# EAGLE design binaryClock (EAGLE 8.4.0)
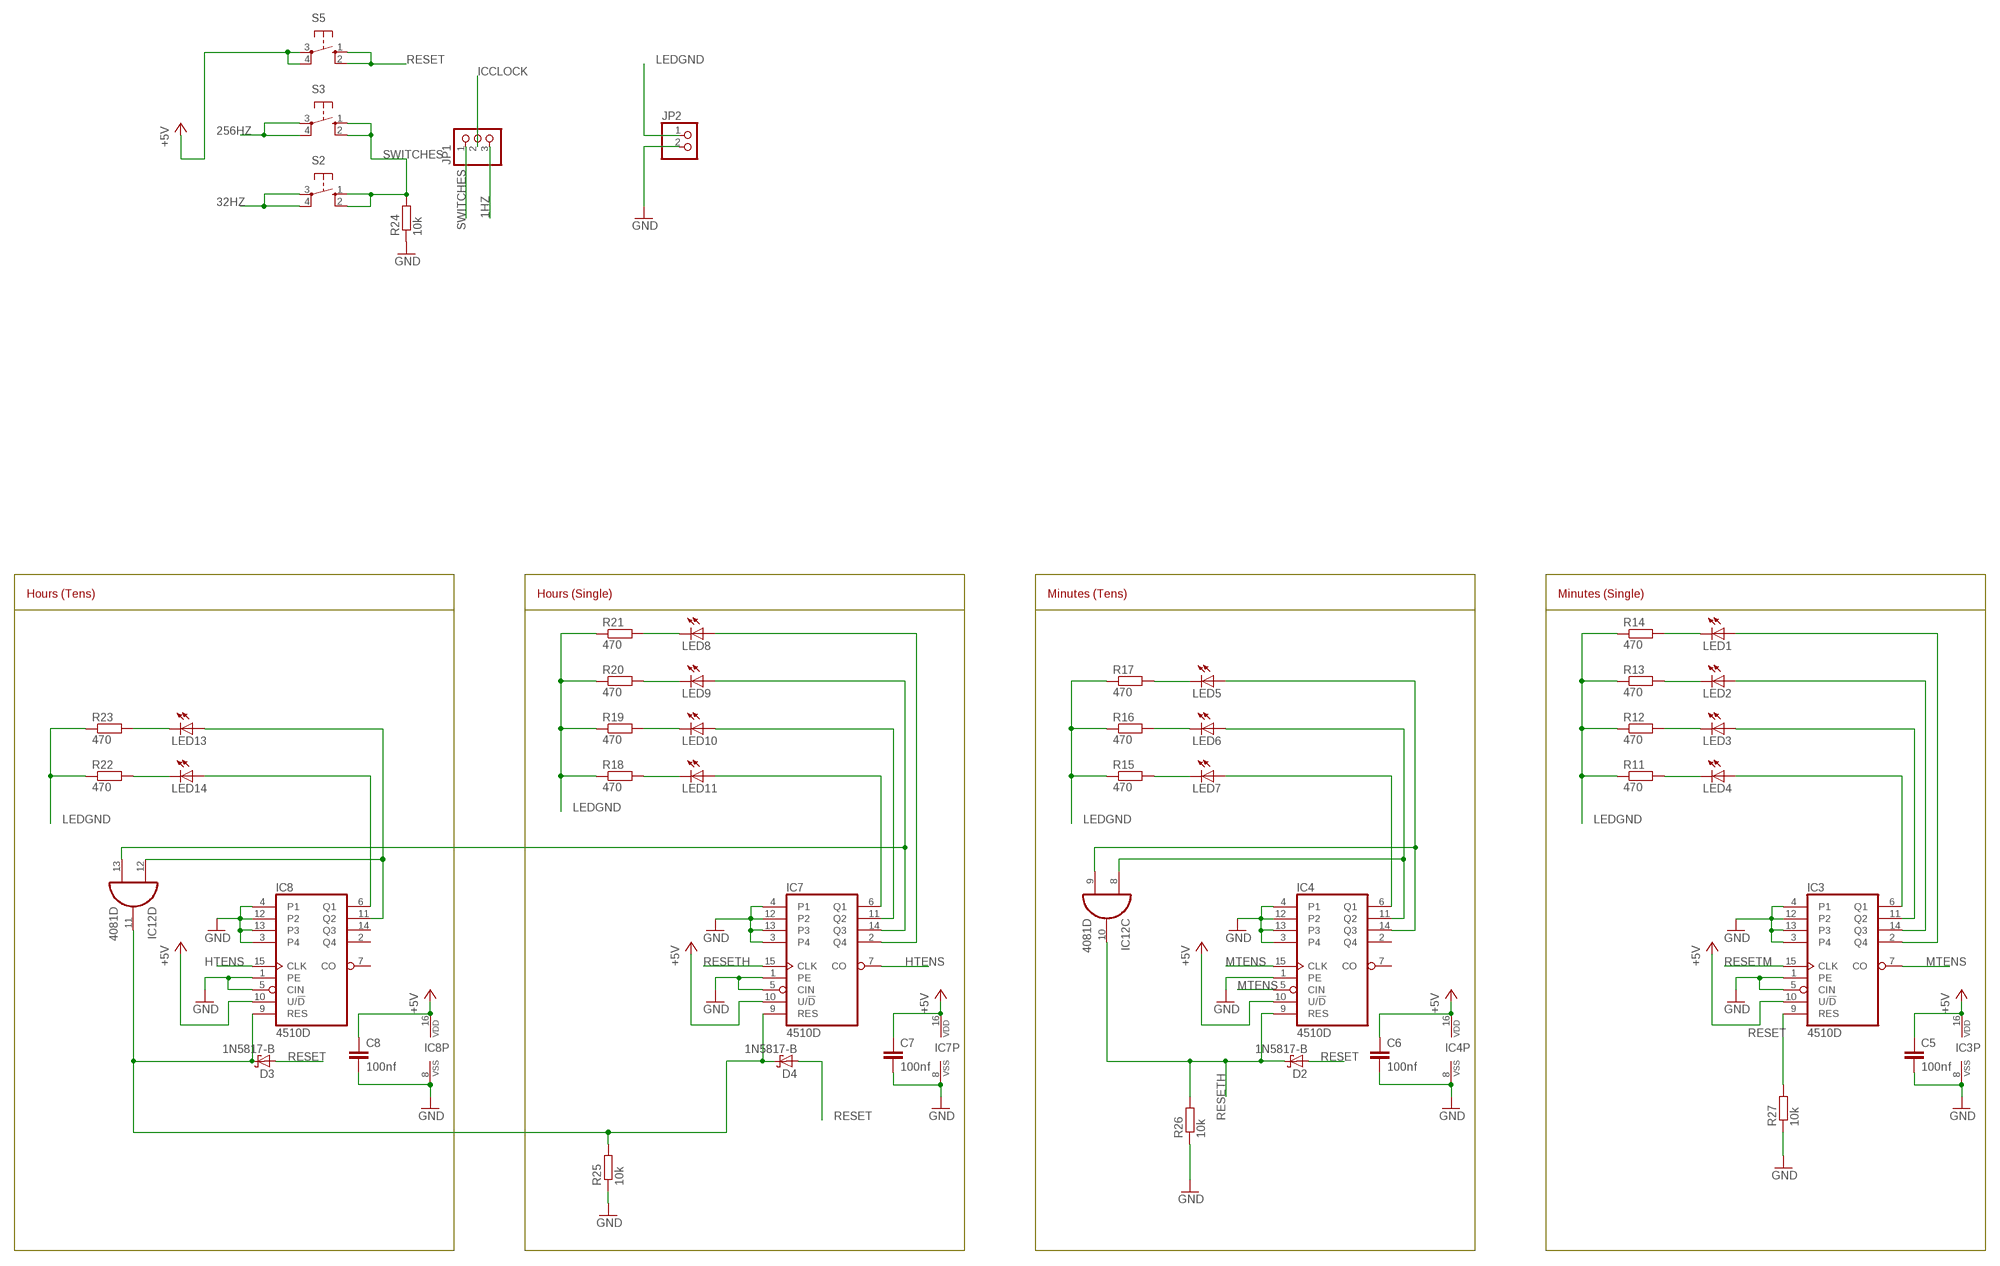
[diagram p0: schematic, sheet 1, part 1 of 2]
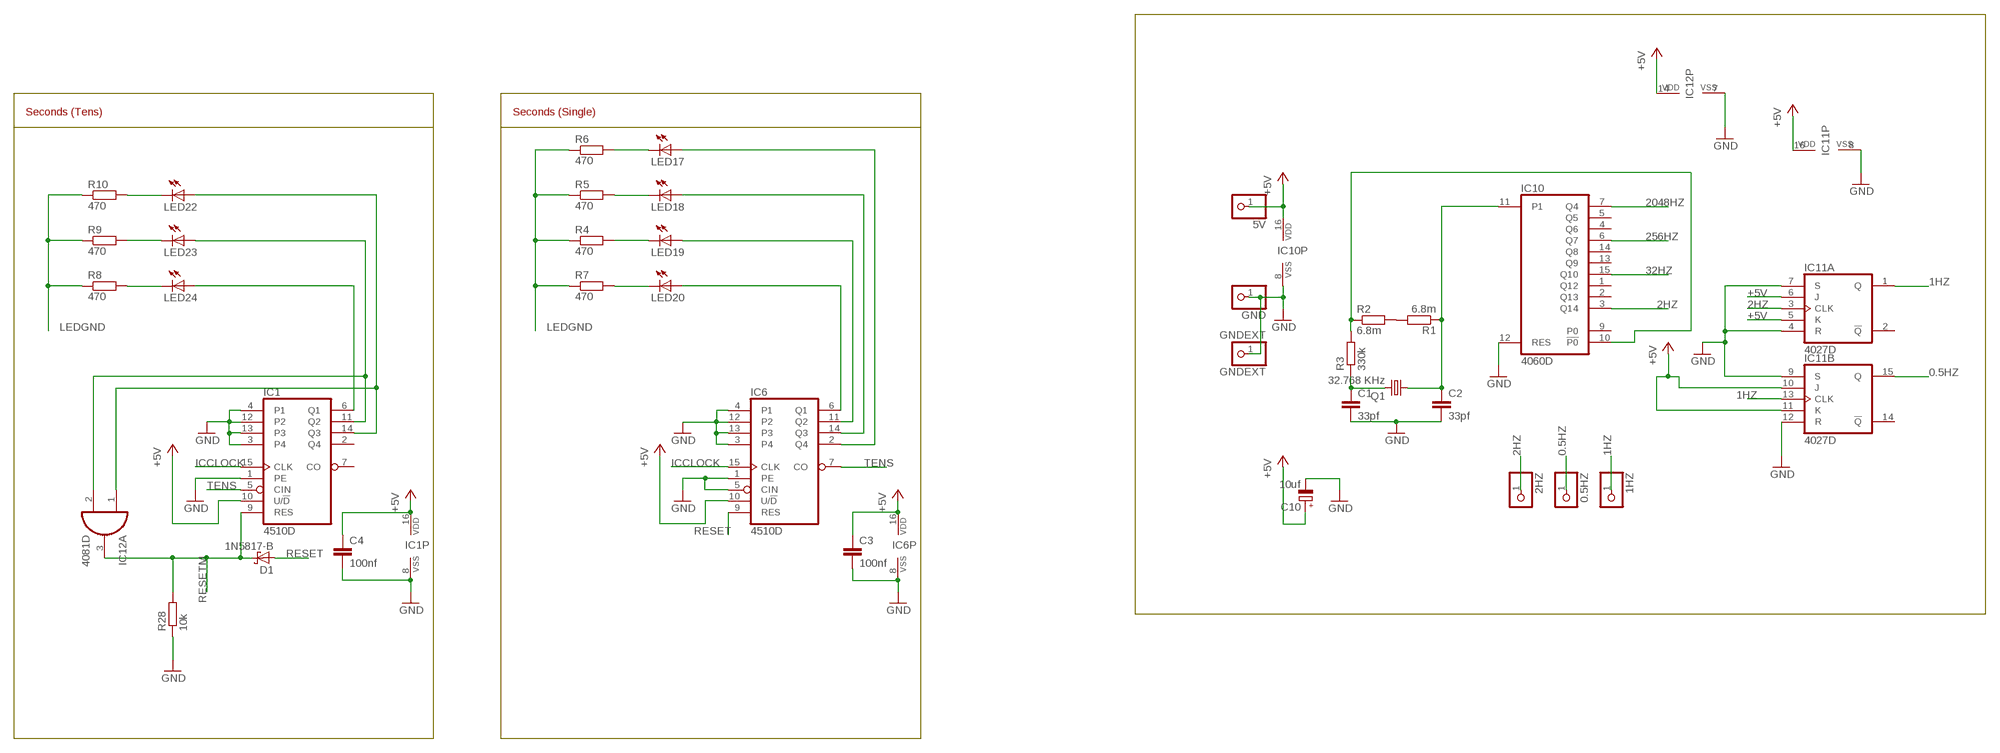
[diagram p1: schematic, sheet 1, part 2 of 2]

## Parts
0.5HZ  PINHD-1X1  [1X01]
1HZ  PINHD-1X1  [1X01]
2HZ  PINHD-1X1  [1X01]
5V  PINHD-1X1  [1X01]
C1  33pf  C-EU025-030X050  [C025-030X050]
C2  33pf  C-EU025-030X050  [C025-030X050]
C3  100nf  C-EU025-030X050  [C025-030X050]
C4  100nf  C-EU025-030X050  [C025-030X050]
C5  100nf  C-EU025-030X050  [C025-030X050]
C6  100nf  C-EU025-030X050  [C025-030X050]
C7  100nf  C-EU025-030X050  [C025-030X050]
C8  100nf  C-EU025-030X050  [C025-030X050]
C10  10uf  CPOL-EUE2.5-5  [E2,5-5]
D1  1N5817-B  [DO41-7.6]
D2  1N5817-B  [DO41-7.6]
D3  1N5817-B  [DO41-7.6]
D4  1N5817-B  [DO41-7.6]
GND  PINHD-1X1  [1X01]
GNDEXT  GNDEXT  PINHD-1X1  [1X01]
IC1  4510D  [SO16]
IC3  4510D  [SO16]
IC4  4510D  [SO16]
IC6  4510D  [SO16]
IC7  4510D  [SO16]
IC8  4510D  [SO16]
IC10  4060D  [SO16]
IC11  4027D  [SO16]
IC12  4081D  [SO14]
JP1  PINHD-1X3  [1X03]
JP2  PINHD-1X2  [1X02]
LED1  LED5MM  [LED5MM]
LED2  LED5MM  [LED5MM]
LED3  LED5MM  [LED5MM]
LED4  LED5MM  [LED5MM]
LED5  LED5MM  [LED5MM]
LED6  LED5MM  [LED5MM]
LED7  LED5MM  [LED5MM]
LED8  LED5MM  [LED5MM]
LED9  LED5MM  [LED5MM]
LED10  LED5MM  [LED5MM]
LED11  LED5MM  [LED5MM]
LED13  LED5MM  [LED5MM]
LED14  LED5MM  [LED5MM]
LED17  LED5MM  [LED5MM]
LED18  LED5MM  [LED5MM]
LED19  LED5MM  [LED5MM]
LED20  LED5MM  [LED5MM]
LED22  LED5MM  [LED5MM]
LED23  LED5MM  [LED5MM]
LED24  LED5MM  [LED5MM]
Q1  32.768 KHz  CRYSTALTC26H  [TC26H]
R1  6.8m  R-EU_R0805  [R0805]
R2  6.8m  R-EU_R0805  [R0805]
R3  330k  R-EU_R0805  [R0805]
R4  470  R-EU_R0805  [R0805]
R5  470  R-EU_R0805  [R0805]
R6  470  R-EU_R0805  [R0805]
R7  470  R-EU_R0805  [R0805]
R8  470  R-EU_R0805  [R0805]
R9  470  R-EU_R0805  [R0805]
R10  470  R-EU_R0805  [R0805]
R11  470  R-EU_R0805  [R0805]
R12  470  R-EU_R0805  [R0805]
R13  470  R-EU_R0805  [R0805]
R14  470  R-EU_R0805  [R0805]
R15  470  R-EU_R0805  [R0805]
R16  470  R-EU_R0805  [R0805]
R17  470  R-EU_R0805  [R0805]
R18  470  R-EU_R0805  [R0805]
R19  470  R-EU_R0805  [R0805]
R20  470  R-EU_R0805  [R0805]
R21  470  R-EU_R0805  [R0805]
R22  470  R-EU_R0805  [R0805]
R23  470  R-EU_R0805  [R0805]
R24  10k  R-EU_R0805  [R0805]
R25  10k  R-EU_R0805  [R0805]
R26  10k  R-EU_R0805  [R0805]
R27  10k  R-EU_R0805  [R0805]
R28  10k  R-EU_R0805  [R0805]
S2  10-XX  [B3F-10XX]
S3  10-XX  [B3F-10XX]
S5  10-XX  [B3F-10XX]

## Nets
0.5HZ: 0.5HZ.1 IC11.15(B:Q)
1HZ: 1HZ.1 IC11.1(A:Q) IC11.13(B:CLK) JP1.3
2HZ: 2HZ.1 IC10.3(Q14) IC11.3(A:CLK)
32HZ: IC10.15(Q10) S2.3(P) S2.4(P1)
256HZ: IC10.6(Q7) S3.3(P) S3.4(P1)
2048HZ: IC10.7(Q4)
+5V: 5V.1 C3.1 C4.1 C5.1 C6.1 C7.1 C8.1 C10.+ IC1.10(U/!D) IC1.16(VDD) IC3.10(U/!D) IC3.16(VDD) IC4.10(U/!D) IC4.16(VDD) IC6.10(U/!D) IC6.16(VDD) IC7.10(U/!D) IC7.16(VDD) IC8.10(U/!D) IC8.16(VDD) IC10.16(VDD) IC11.5(A:K) IC11.6(A:J) IC11.10(B:J) IC11.11(B:K) IC11.16(P:VDD) IC12.14(P:VDD) S5.3(P) S5.4(P1)
GND: C1.2 C2.2 C3.2 C4.2 C5.2 C6.2 C7.2 C8.2 C10.- GND.1 GNDEXT.1 IC1.1(PE) IC1.3(P4) IC1.4(P1) IC1.8(VSS) IC1.12(P2) IC1.13(P3) IC3.1(PE) IC3.3(P4) IC3.4(P1) IC3.5(CIN) IC3.8(VSS) IC3.12(P2) IC3.13(P3) IC4.1(PE) IC4.3(P4) IC4.4(P1) IC4.8(VSS) IC4.12(P2) IC4.13(P3) IC6.1(PE) IC6.3(P4) IC6.4(P1) IC6.5(CIN) IC6.8(VSS) IC6.12(P2) IC6.13(P3) IC7.1(PE) IC7.3(P4) IC7.4(P1) IC7.5(CIN) IC7.8(VSS) IC7.12(P2) IC7.13(P3) IC8.1(PE) IC8.3(P4) IC8.4(P1) IC8.5(CIN) IC8.8(VSS) IC8.12(P2) IC8.13(P3) IC10.8(VSS) IC10.12(RES) IC11.4(A:R) IC11.7(A:S) IC11.8(P:VSS) IC11.9(B:S) IC11.12(B:R) IC12.7(P:VSS) JP2.2 R24.1 R25.1 R26.1 R27.1 R28.1
HTENS: IC7.7(CO) IC8.15(CLK)
ICCLOCK: IC1.15(CLK) IC6.15(CLK) JP1.2
LEDGND: JP2.1 R4.1 R5.1 R6.1 R7.1 R8.1 R9.1 R10.1 R11.1 R12.1 R13.1 R14.1 R15.1 R16.1 R17.1 R18.1 R19.1 R20.1 R21.1 R22.1 R23.1
MTENS: IC3.7(CO) IC4.5(CIN) IC4.15(CLK)
N$1: IC6.6(Q1) LED20.A
N$2: IC6.11(Q2) LED19.A
N$3: R1.2 R2.2
N$4: C1.1 Q1.2 R3.1
N$5: IC10.10(!P0) R2.1 R3.2
N$6: C2.1 IC10.11(P1) Q1.1 R1.1
N$7: IC6.14(Q3) LED18.A
N$8: IC6.2(Q4) LED17.A
N$9: LED17.K(C) R6.2
N$10: LED18.K(C) R5.2
N$11: LED19.K(C) R4.2
N$12: LED20.K(C) R7.2
N$13: IC1.6(Q1) LED24.A
N$14: IC1.11(Q2) IC12.2(A:I1) LED23.A
N$15: IC1.14(Q3) IC12.1(A:I0) LED22.A
N$16: D3.C D4.C IC7.9(RES) IC8.9(RES) IC12.11(D:O) R25.2
N$17: IC7.6(Q1) LED11.A
N$18: LED22.K(C) R10.2
N$19: LED23.K(C) R9.2
N$20: LED24.K(C) R8.2
N$21: IC7.11(Q2) LED10.A
N$22: IC3.6(Q1) LED4.A
N$23: IC3.11(Q2) LED3.A
N$24: IC3.14(Q3) LED2.A
N$25: IC3.2(Q4) LED1.A
N$26: LED1.K(C) R14.2
N$27: LED2.K(C) R13.2
N$28: LED3.K(C) R12.2
N$29: LED4.K(C) R11.2
N$30: IC4.6(Q1) LED7.A
N$31: IC4.11(Q2) IC12.8(C:I0) LED6.A
N$32: IC4.14(Q3) IC12.9(C:I1) LED5.A
N$33: LED5.K(C) R17.2
N$34: LED6.K(C) R16.2
N$35: LED7.K(C) R15.2
N$37: IC7.14(Q3) IC12.13(D:I1) LED9.A
N$38: IC7.2(Q4) LED8.A
N$39: LED8.K(C) R21.2
N$40: LED9.K(C) R20.2
N$41: LED10.K(C) R19.2
N$42: LED11.K(C) R18.2
N$43: IC8.6(Q1) LED14.A
N$44: IC8.11(Q2) IC12.12(D:I0) LED13.A
N$47: LED13.K(C) R23.2
N$48: LED14.K(C) R22.2
RESET: D1.A D2.A D3.A D4.A IC3.9(RES) IC6.9(RES) R27.2 S5.1(S) S5.2(S1)
RESETH: D2.C IC4.9(RES) IC7.15(CLK) IC12.10(C:O) R26.2
RESETM: D1.C IC1.9(RES) IC3.15(CLK) IC12.3(A:O) R28.2
SWITCHES: JP1.1 R24.2 S2.1(S) S2.2(S1) S3.1(S) S3.2(S1)
TENS: IC1.5(CIN) IC6.7(CO)
Unconnected: IC1.2(Q4) IC1.7(CO) IC4.2(Q4) IC4.7(CO) IC8.2(Q4) IC8.7(CO) IC8.14(Q3) IC10.1(Q12) IC10.2(Q13) IC10.4(Q6) IC10.5(Q5) IC10.9(P0) IC10.13(Q9) IC10.14(Q8) IC11.2(A:!Q) IC11.14(B:!Q) IC12.4(B:O) IC12.5(B:I0) IC12.6(B:I1)

## Notes on the sheet
- Hours (Tens) | Hours (Single) | Minutes (Tens) | Minutes (Single) | Seconds (Tens) | Seconds (Single)

## Library data of the parts
0.5HZ 1HZ 2HZ 5V GND GNDEXT = adafruit:PINHD-1X1: Pin header 1x1 for 0.1" spacing With round pins
C1-C8 = resistor:C-EU: CAPACITOR, European symbol
C10 = resistor:CPOL-EU: POLARIZED CAPACITOR, European symbol
D1-D4 = diode:1N581*: 1.0A SCHOTTKY BARRIER RECTIFIER Source: http://www.diodes.com/datasheets/ds23001.pdf
IC1 IC3 IC4 IC6-IC8 = 45xx:4510: BCD up down COUNTER
IC10 = 40xx:4060: 14-stage binary/ripple COUNTER
IC11 = 40xx:4027: Dual JK FLIP FLOP
IC12 = 40xx:4081: Quad 2-input AND
JP1 = pinhead:PINHD-1X3: PIN HEADER
JP2 = pinhead:PINHD-1X2: PIN HEADER
LED1-LED11 LED13 LED14 LED17-LED20 LED22-LED24 = led:LED: LED OSRAM: - CHIPLED LG R971, LG N971, LY N971, LG Q971, LY Q971, LO R971, LY R971 LH N974, LH R974 LS Q976, LO Q976, LY Q976 LO Q996 - Hyper CHIPLED LW Q18S LB Q993, LB Q99A, LB R99A - SideLED LS A670, LO A670, LY A670, LG A670, LP A670 LB A673, LV A673, LT A673, LW A673 LH A674 LY A675 LS A676, LA A676, LO A676, LY A676, LW A676 LS A679, LY A679, LG A679 - Hyper Micro SIDELED® LS Y876, LA Y876, LO Y876, LY Y876 LT Y87S - SmartLED LW L88C, LW L88S LB L89C, LB L89S, LG L890 LS L89K, LO L89K, LY L89K LS L896, LA L896, LO L896, LY L896 - TOPLED LS T670, LO T670, LY T670, LG T670, LP T670 LSG T670, LSP T670, LSY T670, LOP T670, LYG T670 LG T671, LOG T671, LSG T671 LB T673, LV T673, LT T673, LW T673 LH T674 LS T676, LA T676, LO T676, LY T676, LB T676, LH T676, LSB T676, LW T676 LB T67C, LV T67C, LT T67C, LS T67K, LO T67K, LY T67K, LW E67C LS E67B, LA E67B, LO E67B, LY E67B, LB E67C, LV E67C, LT E67C LW T67C LS T679, LY T679, LG T679 LS T770, LO T770, LY T770, LG T770, LP T770 LB T773, LV T773, LT T773, LW T773 LH T774 LS E675, LA E675, LY E675, LS T675 LS T776, LA T776, LO T776, LY T776, LB T776 LHGB T686 LT T68C, LB T68C - Hyper Mini TOPLED® LB M676 - Mini TOPLED Santana® LG M470 LS M47K, LO M47K, LY M47K Source: http://www.osram.convergy.de LUXEON: - LUMILED® LXK2-PW12-R00, LXK2-PW12-S00, LXK2-PW14-U00, LXK2-PW14-V00 LXK2-PM12-R00, LXK2-PM12-S00, LXK2-PM14-U00 LXK2-PE12-Q00, LXK2-PE12-R00, LXK2-PE12-S00, LXK2-PE14-T00, LXK2-PE14-U00 LXK2-PB12-K00, LXK2-PB12-L00, LXK2-PB12-M00, LXK2-PB14-N00, LXK2-PB14-P00, LXK2-PB14-Q00 LXK2-PR12-L00, LXK2-PR12-M00, LXK2-PR14-Q00, LXK2-PR14-R00 LXK2-PD12-Q00, LXK2-PD12-R00, LXK2-PD12-S00 LXK2-PH12-R00, LXK2-PH12-S00 LXK2-PL12-P00, LXK2-PL12-Q00, LXK2-PL12-R00 Source: www.luxeon.com KINGBRIGHT: KA-3528ASYC Source: www.kingbright.com
Q1 = crystal:CRYSTAL: CRYSTAL; OC_FARNELL: unknown; OC_NEWARK: unknown
R1-R28 = resistor:R-EU_: RESISTOR, European symbol
S2 S3 S5 = switch-omron:10-XX: OMRON SWITCH; MPN: B3F-1000; OC_FARNELL: 176432; OC_NEWARK: 36M3542

## Board
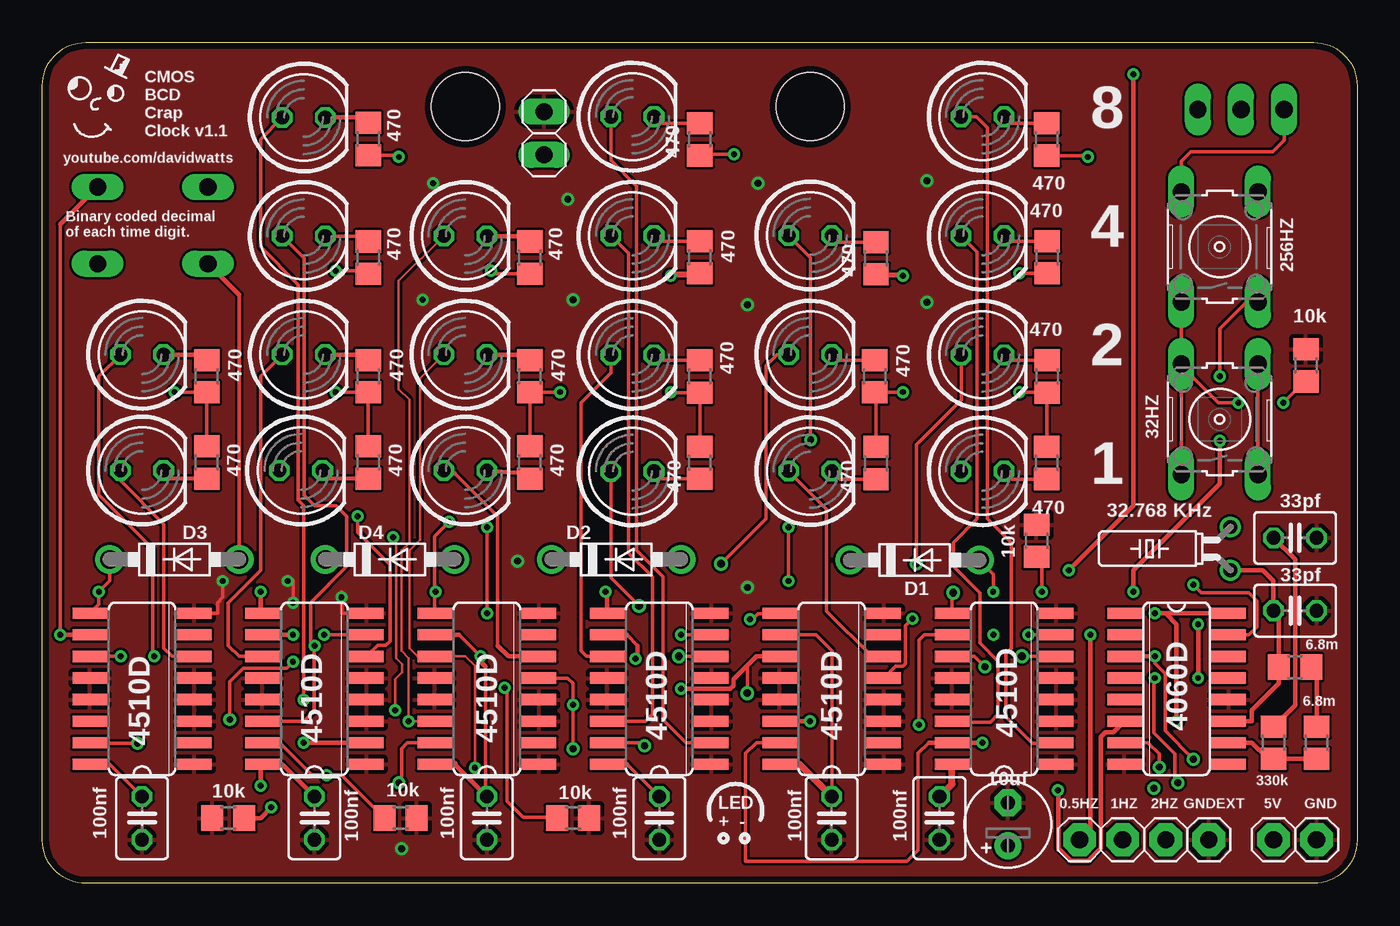
[diagram p2: board, top side]
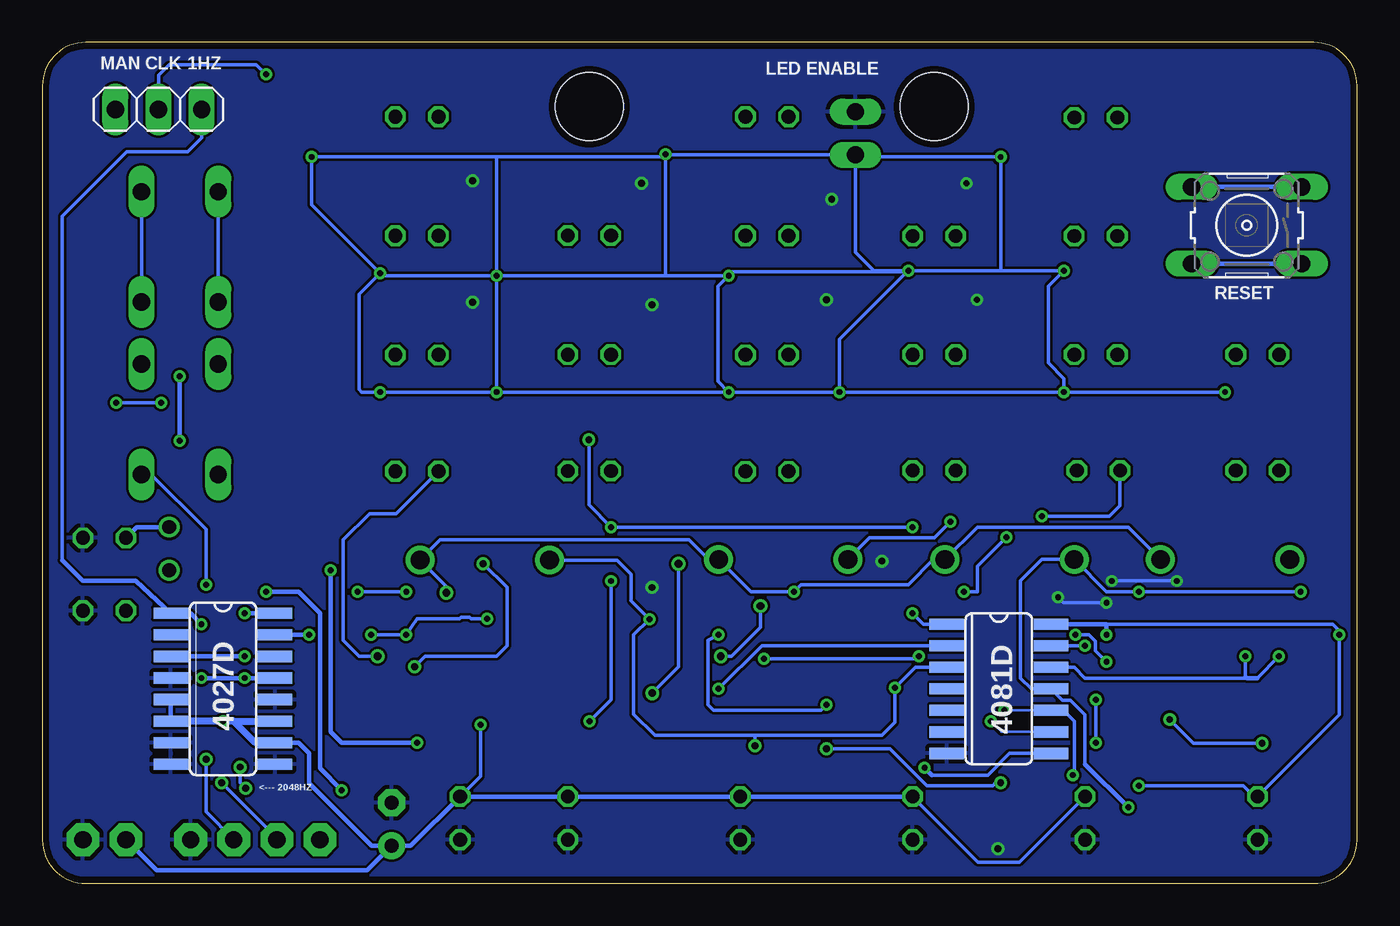
[diagram p3: board, bottom side, seen from below]

Size 77.47 x 49.53 mm. Coordinates in mm from the lower left corner, seen from the top.
Outline: 0,2.54 0,46.99 arc-90 2.54,49.53 74.93,49.53 arc-90 77.47,46.99 77.47,2.54 arc-90 74.93,0 2.54,0 arc-90 0,2.54
Copper layers (1*16): Top 0.0356mm / dielectric 1.5011mm / Bottom 0.0356mm
Design rules "oshpark-2layer": minimum track width 6mil, minimum drill 13mil, track to track 6mil, track to pad 6mil, pad to pad 6mil, via to via 6mil, smd to smd 6mil, copper to edge 15mil, drill to drill 6mil, minimum pad ring 7mil, minimum via ring 7mil, stop-mask expansion 2.5mil, vias tented up to drill 0mil, thermal gap 10mil
Holes 4 mm at 24.92,45.75 45.24,45.75

### Footprints (pad centres in the part's own frame; a part is rotated, then mirrored left to right if it is on the bottom)
1X01 = drill 1.016 pad 1.93 octagon: 1 0,0
C025-030X050 = drill 0.813 octagon: 1 -1.27,0; 2 1.27,0
E2,5-5 = drill 0.813 pad 1.6: + -1.27,0 | drill 0.813 pad 1.6 octagon: - 1.27,0
DO41-7.6 = drill 1.1 pad 1.7: A 3.81,0; C -3.81,0
SO16 = smd 0.66 x 2.032: 1 -4.445,-3.073; 2 -3.175,-3.073; 3 -1.905,-3.073; 4 -0.635,-3.073; 5 0.635,-3.073; 6 1.905,-3.073; 7 3.175,-3.073; 8 4.445,-3.073; 9 4.445,3.073; 10 3.175,3.073; 11 1.905,3.073; 12 0.635,3.073; 13 -0.635,3.073; 14 -1.905,3.073; 15 -3.175,3.073; 16 -4.445,3.073
SO14 = smd 0.66 x 2.032: 1 -3.81,-3.073; 2 -2.54,-3.073; 3 -1.27,-3.073; 4 0,-3.073; 5 1.27,-3.073; 6 2.54,-3.073; 7 3.81,-3.073; 8 3.81,3.073; 9 2.54,3.073; 10 1.27,3.073; 11 0,3.073; 12 -1.27,3.073; 13 -2.54,3.073; 14 -3.81,3.073
1X03 = drill 1.016 long: 1 -2.54,0; 2 0,0; 3 2.54,0
1X02 = drill 1.016 long: 1 -1.27,0; 2 1.27,0
LED5MM = drill 0.813 octagon: A -1.27,0; K 1.27,0
TC26H = drill 0.813: 1 -1.27,0; 2 1.27,0
R0805 = smd 1.3 x 1.5: 1 -0.95,0; 2 0.95,0
B3F-10XX = drill 1.016 long: 1 -3.251,2.261; 2 3.251,2.261; 3 -3.251,-2.261; 4 3.251,-2.261

### Placement (x,y rotation side)
0.5HZ  61.12,2.57 0 top
1HZ  63.66,2.57 0 top
2HZ  66.2,2.57 0 top
5V  72.55,2.57 0 top
C1  73.82,20.35 0 top
C2  73.82,16.06 0 top
C3  5.87,3.84 270 top
C4  26.19,3.84 270 top
C5  46.51,3.84 270 top
C6  16.03,3.84 270 top
C7  36.35,3.84 270 top
C8  52.86,3.84 270 top
C10  56.89,3.48 90 top
D1  51.4,19.04 0 top
D2  33.81,19.08 0 top
D3  7.78,19.08 0 top
D4  20.48,19.08 0 top
GND  75.09,2.57 0 top
GNDEXT  68.74,2.57 0 top
IC1  46.51,11.46 90 top
IC3  36.35,11.46 90 top
IC4  26.19,11.46 90 top
IC6  56.67,11.46 90 top
IC7  16.03,11.46 90 top
IC8  5.87,11.46 90 top
IC10  66.83,11.46 270 top
IC11  66.83,11.46 270 bottom
IC12  21.11,11.46 270 bottom
JP1  70.63,45.58 0 bottom
JP2  29.56,44.18 90 top
LED1  34.77,45.16 0 top
LED2  34.77,38.14 0 top
LED3  34.77,31.12 0 top
LED4  34.77,24.26 0 top
LED5  24.92,38.13 0 top
LED6  24.92,31.14 0 top
LED7  24.92,24.31 0 top
LED8  15.4,45.11 0 top
LED9  15.4,38.13 0 top
LED10  15.4,31.14 0 top
LED11  15.24,24.31 0 top
LED13  5.87,31.14 0 top
LED14  5.87,24.31 0 top
LED17  55.4,45.16 0 top
LED18  55.4,38.14 0 top
LED19  55.4,31.12 0 top
LED20  55.4,24.27 0 top
LED22  45.24,38.16 0 top
LED23  45.24,31.14 0 top
LED24  45.24,24.28 0 top
Q1  70.01,19.71 90 top
R1  73.82,12.73 0 top
R2  75.09,8.28 90 top
R3  72.55,8.28 270 top
R4  59.21,29.85 90 top
R5  59.21,36.87 90 top
R6  59.18,43.82 90 top
R7  59.18,24.76 270 top
R8  49.12,24.75 270 top
R9  49.05,29.87 90 top
R10  49.12,36.82 90 top
R11  38.74,24.77 270 top
R12  38.73,29.85 90 top
R13  38.73,36.87 90 top
R14  38.74,43.82 90 top
R15  28.73,24.79 270 top
R16  28.73,29.87 90 top
R17  28.73,36.86 90 top
R18  19.21,24.79 270 top
R19  19.21,29.87 90 top
R20  19.21,36.86 90 top
R21  19.21,43.84 90 top
R22  9.68,24.79 270 top
R23  9.68,29.87 90 top
R24  74.45,30.51 270 top
R25  10.95,3.84 0 top
R26  21.11,3.84 180 top
R27  58.58,20.18 270 top
R28  31.27,3.84 180 top
S2  69.37,27.33 90 top
S3  69.37,37.49 90 top
S5  6.51,38.76 180 bottom

### Tracks (layer width: path | path; a pad name or v marks a point on that pad's centre or on a via)
0.5HZ  (via drill 0.35)
  Top 0.254: 0.5HZ.1 61.75,3.2 v61.75,14.63
  Bottom 0.254: v61.75,14.63 IC11.15
1HZ  (via drill 0.35, 0.41 pad 0.3)
  Top 0.203: 1HZ.1 63.66,2.67 | v65.56,12.09 65.5,12.03 65.5,8.87 66.74,7.62 66.74,6.07 v66.9,5.91
  Top 0.254: v68.1,12.09 v68.1,15.27
  Bottom 0.203: 76.31,19.03 76.31,39.28 72.5,43.09 68.92,43.09 68.09,43.92 JP1.3 | v66.9,5.91 63.66,2.67 1HZ.1
  Bottom 0.254: v68.1,15.27 68.74,15.9 IC11.1 71.97,17.8 75.09,17.8 76.31,19.03 | IC11.13 v65.56,12.09 v68.1,12.09
2HZ  (via drill 0.35, 0.41 pad 0.3)
  Top 0.203: v65.56,13.36 65.56,12.95 66.17,12.34 66.17,8.97 v67.83,7.31
  Top 0.254: IC10.3 v65.56,13.36
  Bottom 0.203: v67.83,7.31 67.83,4.2 2HZ.1
  Bottom 0.254: IC11.3 v65.56,13.36
32HZ  (via drill 0.35)
  Top 0.203: S2.3 S2.4 | v67.83,17.58 68.3,17.11 71.1,17.11 71.56,16.65 71.56,15.09 71.1,14.62 IC10.15
  Top 0.254: 71.71,24.16 S2.3
  Bottom 0.203: 71.63,24.11 71.67,24.16 71.14,24.16 67.83,20.85 v67.83,17.58
  Bottom 0.254: 71.63,24.11 S2.3
256HZ  (via drill 0.35)
  Top 0.203: S3.3 70.95,34.24 69.39,32.67 69.39,29.89 v69.37,29.87
  Top 0.254: v69.37,26.06 69.37,23.52 64.29,18.44 v64.29,17.17 | IC10.6 63.1,8.89 62.62,8.89 62.36,8.62 62.36,2.05 61.63,1.32 60.6,1.32 59.87,2.05 59.87,5.15 v59.85,5.49
  Bottom 0.203: S3.3 S3.4
  Bottom 0.254: v69.37,29.87 v69.37,26.06 | v64.29,17.17 62.39,17.17 61.12,15.9 61.12,6.76 v59.85,5.49
2048HZ  (via drill 0.41 pad 0.3)
  Top 0.203: IC10.7 65.15,8.28 65.81,7.62 v65.81,6.84
  Bottom 0.203: v65.81,6.84 65.81,5.91 v65.5,5.6
+5V  (via drill 0.35)
  Top 0.203: v1.04,14.63 1.04,38.81 | v25.81,13.36 24.55,14.63 | 34.45,14.63 35.08,13.99 | 26.11,5.18 26.11,12.74 | 34.45,7.01 C7.1 | 52.98,14.63 IC6.10 | IC6.10 52.75,14.63 | IC1.10 45.58,14.63 46.52,13.69 46.52,5.13 C5.1 | IC8.16 3.97,7.01 C3.1 | IC6.10 51.97,14.63 51.65,14.31 v51.65,9.34
  Top 0.254: v66.83,9.55 66.83,15.27 66.2,15.9 v65.56,15.9 IC10.16 | IC8.10 v1.04,14.63 | 1.04,38.81 S5.3 | 24.55,14.63 IC4.10 | IC3.10 34.45,14.63 | 35.08,13.99 35.08,13.36 v34.95,13.23 | IC7.10 v14.76,14.63 | v25.81,13.36 25.81,13.04 26.11,12.74 | 26.11,5.18 C4.1 24.29,7.01 | C6.1 14.13,7.01 IC7.16 12.86,6.91 v12.86,5.74 | IC3.16 34.45,7.01
  Top 0.406: IC4.16 24.29,7.01 | IC1.16 44.61,7.01 C5.1 | IC6.16 53.6,5.84 C8.1
  Bottom 0.203: 14.76,15.27 1.43,15.27 0.82,14.66 | 25.94,13.23 v34.95,13.23 | v1.04,14.63 1.04,9.93 C3.1 6.04,5.11 6.69,5.76 12.84,5.76 v12.86,5.74 | v51.65,9.34 51.65,6.32 C8.1 | C6.1 19.89,1.25 22.33,1.25 C4.1
  Bottom 0.254: 5V.1 70.74,0.76 58.34,0.76 C10.+ | IC11.10 62.39,8.28 61.75,7.64 61.75,5.9 58.06,2.21 C10.+ | IC11.6 IC11.5 | IC11.16 v65.56,15.9 | IC12.14 14.76,15.27 v14.76,14.63 | 0.82,14.66 1.02,14.66 v1.04,14.63 | S5.3 S5.4 | v25.81,13.36 25.94,13.23 | C4.1 C7.1 C5.1 C8.1 55.74,2.22 | 55.74,2.22 55.76,2.21 | C10.+ 55.76,2.21 | 55.76,2.21 55.74,2.22
  Bottom 0.406: 66.2,9.55 v66.83,9.55 IC11.6 | 66.2,9.55 IC11.11 | IC11.10 64.93,8.28 66.2,9.55
GND  (via drill 0.35, 0.41 pad 0.3)
  Top 0.203: IC7.8 17.62,15.9 v17.62,16.85 17.62,17.17 | v14.76,16.54 14.76,17.8 v14.44,17.8 | v10.63,17.8 10.63,16.85 10.32,16.54 10.32,15.9 IC8.8
  Bottom 0.203: v17.62,16.85 17.3,16.54 v14.76,16.54 | v10.63,17.8 v14.44,17.8
  other vias: 23.03,41.23 22.4,34.38 30.96,40.29 31.27,34.38 42.16,41.23 41.54,34.07 52.12,41.38 52.12,34.23 28,18.98 41.54,17.42 21.16,2.02
  pour Top: -3.11,53.36 80.59,53.36 80.59,-2.64 -3.11,-2.64
  pour Bottom: -4.82,55.23 81.99,55.23 81.99,-5.6 -4.82,-5.6
HTENS  (via drill 0.35, 0.41 pad 0.3)
  Top 0.203: v14.76,13.04 14.39,12.68 11.84,12.68 11.05,11.88 v11.05,9.65 | v16.61,14.63 IC7.7 | v5.6,8.24 2.83,8.24 IC8.15
  Bottom 0.203: v14.76,13.04 15.42,13.71 15.42,14.25 15.81,14.63 v16.61,14.63 | v11.05,9.65 9.65,8.24 v5.6,8.24
ICCLOCK  (via drill 0.35)
  Top 0.203: 52.23,8.28 51.59,7.64 51.59,1.93 50.96,1.29 41.43,1.29 41.43,7.64 42.07,8.28 IC1.15
  Top 0.254: 52.23,8.28 IC6.15 v55.4,8.28 | v64.29,47.65 64.29,22.25 v60.48,18.44
  Bottom 0.203: v64.29,47.65 64.87,48.23 70.01,48.23 70.63,47.61 JP1.2
  Bottom 0.254: v60.48,18.44 60.48,8.91 59.85,8.28 v55.4,8.28
LEDGND  (via drill 0.35)
  Top 0.203: R22.1 R23.1 7.79,28.92 v7.78,28.94 | R18.1 R19.1 19.19,28.94 v17.27,28.94 | R15.1 R16.1 30.48,28.92 v30.49,28.94 | R21.1 20.89,42.89 v21,42.78 | 38.94,42.94 v40.76,42.94 38.81,42.94 R14.1 | 61.57,42.9 61.61,42.94 v61.61,42.78 61.52,42.87 R6.1 | v57.56,35.94 57.59,35.91 57.61,35.92 R5.1 | 49.17,35.78 v50.72,35.78 50.63,35.87 R10.1 | R9.1 50.7,28.92 | 50.7,28.92 v50.72,28.94 | 37.04,28.92 v37.03,28.94 37.06,28.91 R12.1 R11.1 | 38.77,35.78 v37.03,35.78 37.17,35.92 R13.1 | R20.1 19.02,36.09 v17.27,36.09 | v26.45,36.09 26.64,35.91 R17.1 | R7.1 59.18,28.88 R4.1 59.18,28.94 v57.56,28.94 | R9.1 50.7,28.92 | R8.1 49.12,28.85 R9.1
  Bottom 0.203: JP2.1 29.43,42.78 v21,42.78 21,36.09 | 40.76,42.91 JP2.1 | 40.76,42.91 40.89,42.91 40.92,42.94 v40.76,42.94 40.76,35.78 | 50.72,42.78 40.89,42.78 40.76,42.91 | 50.72,42.78 v61.61,42.78 61.61,39.98 v57.56,35.94 | v57.56,35.94 58.81,34.69 58.81,29.09 58.65,28.94 v57.56,28.94 v50.72,28.94 | 50.87,35.78 v50.72,35.78 | 50.87,35.78 57.41,35.78 v57.56,35.94 | v50.72,28.94 50.72,35.63 50.87,35.78 | v37.03,28.94 v50.72,28.94 | v37.03,28.94 37.65,29.56 37.65,35.16 v37.03,35.78 | 40.76,35.78 v50.72,35.78 | 40.76,35.78 v37.03,35.78 | v37.03,28.94 v30.49,28.94 | v17.27,28.94 v30.49,28.94 | v7.78,28.94 v17.27,28.94 | 21,36.09 v26.45,36.09 | 21,36.09 v17.27,36.09 18.2,35.16 18.2,30.65 17.27,29.71 v17.27,28.94 | v30.49,28.94 30.49,32.05 26.53,36.02 | 26.53,36.02 v26.45,36.09 | v50.72,35.78 50.72,42.78 | v26.45,36.09 28.47,36.09 29.56,37.18 JP2.1 | v37.03,35.78 36.79,36.02 26.53,36.02
MTENS  (via drill 0.35, 0.41 pad 0.3)
  Top 0.203: IC3.7 v37.63,14.63 | IC4.5 30.95,12.09 31.27,11.77 v31.27,10.5 v31.27,7.93 | IC4.15 21.5,8.28 21.16,7.93 21.16,6.07 v21,5.91
  Bottom 0.203: v37.63,14.63 38.26,14.31 38.26,10.5 37.94,10.19 31.59,10.19 v31.27,10.5 | v21,5.91 21.31,5.91 21.47,5.76 25.36,5.76 27.54,7.93 v31.27,7.93
N$1  (via drill 0.46 pad 0.3)
  Top 0.203: v57.72,13.38 57.74,13.36 IC6.6
  Bottom 0.203: LED20.A 56.62,21.78 58.19,21.78 59.74,20.23 59.74,14.31 58.81,13.38 v57.72,13.38
N$2  (via drill 0.41 pad 0.3)
  Top 0.203: IC6.11 54.74,13.36 54.76,13.38 54.92,13.38 v55.54,12.76 | v51.49,18.82 51.49,25.82 54.14,28.47 LED19.A
  Bottom 0.203: v55.54,12.76 54.92,13.38 50.72,13.38 50.09,14 50.09,17.42 v51.49,18.82
N$3
  Top 0.254: R2.2 75.09,12.4 R1.2
N$4
  Top 0.254: R3.1 73.82,10.5 73.82,19.07 C1.1
  Bottom 0.254: Q1.2 71.91,20.98 C1.1
N$5
  Top 0.254: IC10.10 71.28,8.28 72.23,7.33 R3.2 R2.1
N$6
  Top 0.254: IC10.11 71.28,9.55 71.28,10.19 72.87,11.78 R1.1 72.87,15.58 C2.1 72.55,17.8 71.91,18.44 Q1.1
N$7
  Top 0.203: LED18.A 55.07,37.2 55.07,21.47 53.67,20.07 53.67,18.67 55.23,17.11 55.23,14.16 56.32,13.07 56.32,9.96 55.85,9.49 53.66,9.49 IC6.14
N$8
  Top 0.203: LED17.A 55.03,45.16 55.7,44.49 55.7,26.29 | 55.7,26.29 55.7,26.45 55.7,26.29 | 55.7,26.29 55.7,21.47 57.1,20.07 57.1,13.85 56.78,13.54 56.78,9.8 58.34,8.24 59.71,8.24 IC6.2
N$9
  Top 0.203: R6.2 57.06,44.77 LED17.K
N$10
  Top 0.203: R5.2 56.99,37.82 LED18.K
N$11
  Top 0.203: R4.2 56.99,30.8 LED19.K
N$12
  Top 0.203: R7.2 57.13,23.81 LED20.K
N$13
  Top 0.203: 48.7,13.53 48.7,13.38 48.71,13.36 IC1.6 48.87,13.36 46.21,16.02 46.21,22.04 LED24.A
N$14  (via drill 0.35, 0.46 pad 0.3)
  Top 0.203: LED23.A 43.27,31.14 42.63,30.49 42.63,21.47 v39.98,18.82 | v41.54,11.2 41.54,12.83 41.73,13.03
  Top 0.254: v37.62,11.46 40.53,11.46 40.72,11.64 40.72,12.01 41.73,13.03 42.07,13.36 IC1.11
  Bottom 0.203: IC12.2 35.08,13.99 v37.62,11.46 | v39.98,18.82 39.98,12.76 v41.54,11.2
N$15  (via drill 0.35, 0.41 pad 0.3)
  Top 0.203: v43.97,17.8 v43.97,20.98 | v26.19,20.98 v26.19,15.9 | v45.27,26.14 45.27,36.85 LED22.A
  Top 0.254: IC1.14 v45.24,9.55
  Bottom 0.203: v45.24,9.55 43.97,10.82 v43.97,17.8 | v26.19,20.98 v43.97,20.98 45.27,22.28 v45.27,26.14 | v26.19,15.9 25.56,15.27 IC12.1
N$16  (via drill 0.35)
  Top 0.203: IC8.9 3.33,16.43 v3.33,17.17 3.97,17.8 D3.C
  Top 0.254: IC7.9 12.86,16 v12.86,17.17 | v13.49,4.47 12.86,3.83 R25.2
  Bottom 0.203: v3.33,17.17 v12.86,17.17 14.76,17.17 D4.C 18.57,19.07 19.84,17.8 19.84,12.09 19.21,11.46 IC12.11 17.38,10.79 16.91,10.79 16.03,9.92 16.03,7.01
  Bottom 0.254: 16.03,7.01 v13.49,4.47
N$17  (via drill 0.35)
  Top 0.203: IC7.6 19.76,14.02 20.24,14.02 20.48,14.26 20.48,18.76 18.57,20.66 v18.57,21.61
  Bottom 0.203: LED11.A 13.97,22.25 14.61,21.61 v18.57,21.61
N$18
  Top 0.203: R10.2 46.9,37.77 LED22.K
N$19
  Top 0.203: R9.2 46.83,30.82 LED23.K
N$20
  Top 0.203: R8.2 46.99,23.8 LED24.K
N$21
  Top 0.203: IC7.11 11.59,13.36 10.95,13.99 10.95,16.54 12.86,18.44 12.86,29.87 LED10.A
N$22  (via drill 0.46 pad 0.3)
  Top 0.203: LED4.A 33.5,18 v35.16,16.34 | IC3.6 37.51,13.36 v37.49,13.38
  Bottom 0.203: v35.16,16.34 35.16,15.09 36.87,13.38 v37.49,13.38 | v37.49,13.38 37.65,13.38 v37.49,13.38
N$23
  Top 0.203: LED3.A 33.5,30.08 31.74,28.32 31.74,13.69 32.07,13.36 IC3.11
N$24
  Top 0.203: IC3.14 35.53,9.55 35.94,9.96 35.94,18.05 34.54,19.45 34.54,37.1 LED2.A
N$25
  Top 0.203: LED1.A 33.5,42.58 35,41.07 35,19.6 36.56,18.05 36.56,9.65 37.92,8.28 IC3.2
N$26
  Top 0.203: R14.2 36.43,44.77 LED1.K
N$27
  Top 0.203: R13.2 36.36,37.82 LED2.K
N$28
  Top 0.203: R12.2 36.36,30.8 LED3.K
N$29
  Top 0.203: R11.2 36.48,23.82 LED4.K
N$30
  Top 0.203: 26.83,13.99 26.83,21.61 24.29,24.16
  Top 0.254: IC4.6 27.46,13.36 26.83,13.99 | 24.29,24.16 LED7.A
N$31  (via drill 0.35)
  Top 0.152: v25.48,6.82 25.48,12.8 24.92,13.36 IC4.11 22.11,13.36 21.62,13.85 21.62,19.6 22.25,20.23 22.25,29.74 LED6.A
  Bottom 0.203: IC12.8 20.48,7.64 21.75,6.38 25.04,6.38
  Bottom 0.254: 25.04,6.38 v25.48,6.82
N$32  (via drill 0.35)
  Top 0.152: 22.38,9.55 IC4.14 v21.58,9.55 21.58,13.27 21.16,13.69 21.16,19.6 21.62,20.07 21.62,28.47 21,29.09 21,35.48 LED5.A
  Bottom 0.152: v21.58,9.55 20.95,8.91 IC12.9
N$33
  Top 0.254: LED5.K 28.41,38.12 R17.2
N$34
  Top 0.254: LED6.K 28.41,31.14 R16.2
N$35
  Top 0.254: LED7.K 28.42,24.16 R15.2
N$37  (via drill 0.35)
  Top 0.203: IC7.14 15.4,9.55 16.02,10.18 v16.02,14 | LED9.A 15.43,36.82 15.43,22.85 16.03,22.25 17.3,22.25 17.94,21.61 17.94,18.67 15.8,16.54 15.8,14.22 v16.02,14 | v16.03,13.99 v16.02,14
  Bottom 0.203: IC12.13 v16.03,13.99
N$38  (via drill 0.35)
  Top 0.203: v15.4,10.82 15.4,22.25 15.08,22.57 15.08,35.27 12.86,37.49 12.86,43.84 LED8.A
  Top 0.254: IC7.2 v15.4,8.28
  Bottom 0.203: v15.4,8.28 v15.4,10.82
N$39
  Top 0.254: LED8.K 18.89,45.11 R21.2
N$40
  Top 0.203: R20.2 18.89,38.12 LED9.K
N$41
  Top 0.254: LED10.K 18.89,31.14 R19.2
N$42
  Top 0.254: LED11.K 16.87,23.84 R18.2
N$43
  Top 0.203: IC8.6 7.64,13.36 7.16,13.85 7.16,21.16 4.6,23.71 LED14.A
N$44  (via drill 0.35)
  Top 0.203: IC8.11 v4.6,13.36 | LED13.A 3.33,29.87 3.33,22.89 6.51,19.71 6.51,13.36
  Top 0.254: 6.51,13.36 v6.58,13.36
  Bottom 0.203: v4.6,13.36 5.87,12.09 | 6.51,12.09 16.03,12.09 16.67,12.72 IC12.12 | v6.58,13.36 6.58,12.16
  Bottom 0.254: 5.87,12.09 6.51,12.09 6.58,12.16
N$47
  Top 0.254: LED13.K 9.36,31.14 R23.2
N$48
  Top 0.254: LED14.K 7.5,23.84 R22.2
RESET  (via drill 0.35, 0.46 pad 0.3)
  Top 0.203: 11.59,34.67 D3.A | v56.03,17.17 56.04,17.48 56.04,18.21 D1.A | R27.2 58.89,18.92 v58.89,17.17 | IC6.9 53.6,17.04 v53.67,17.11
  Top 0.254: v33.18,17.17 33.28,17.07 IC3.9 | S5.2 11.59,34.67
  Bottom 0.203: D3.A 13.49,20.98 22.38,20.98 D4.A 24.95,19.07 26.45,17.58 32.77,17.58 v33.18,17.17 35.72,17.17 D2.A 38.21,19.07 39.36,20.23 54.03,20.23 D1.A 53.67,17.5 v53.67,17.11 | v58.89,17.17 v56.03,17.17
  Bottom 0.254: S5.1 S5.2
RESETH  (via drill 0.35)
  Top 0.152: 20.79,10.5 v20.79,10.19 20.79,12.01 21.2,12.42 21.2,12.9 20.85,13.26 20.85,20.2 v20.67,20.37
  Top 0.203: R26.2 17.62,6.38 | v23.97,21.3 23.12,20.45 23.12,17.17 | 23.12,17.17 IC4.9 | v20.67,20.37 20.83,20.21 | v23.17,17.17 23.12,17.17 | IC7.15 13.97,8.28 15.87,6.38 16.66,6.38 16.67,6.38
  Top 0.254: 17.62,6.38 v16.74,6.38 16.67,6.38
  Bottom 0.152: IC12.10 v20.79,10.19
  Bottom 0.203: 17.3,10.19 16.67,9.55 16.67,6.45 | D2.C 28.73,20.34 24.92,20.34 v23.97,21.3 | v20.67,20.37 22.38,18.66 22.38,17.17 v23.17,17.17
  Bottom 0.254: 17.3,10.19 IC12.10 | v16.74,6.38 16.67,6.45
RESETM  (via drill 0.35, 0.41 pad 0.3)
  Top 0.203: R28.2 30.27,3.89 28.32,3.89 27.38,4.82 27.38,11.51 v27.23,11.51 | v41.69,15.56 41.85,15.56 42.16,15.87 43.41,15.87 IC1.9 | IC3.15 35.28,8.28 v35.47,8.09
  Bottom 0.203: IC12.3 26.01,12.72 v27.23,11.51 27.23,9.49 28,8.71 35.47,8.71 | 35.47,8.71 41.38,8.71 42.63,9.96 42.63,14.62 v41.69,15.56 42.78,16.65 42.78,18.2 43.62,19.04 D1.C | v35.47,8.09 35.47,8.71
SWITCHES  (via drill 0.35)
  Top 0.203: R24.2 74.36,29.55 v73.12,28.32 | 67.11,30.49 S2.2 S3.1 | 67.11,30.49 S2.1 | v70.47,28.32 69.29,28.32 67.11,30.49 | S3.2 67.11,42.53 67.67,43.09 72.5,43.09 73.17,43.77 JP1.1
  Bottom 0.203: S3.2 S3.1 | v73.12,28.32 v70.47,28.32
TENS  (via drill 0.35)
  Top 0.203: v58.1,14.63 IC6.7 | IC1.5 50.27,12.78 50.7,12.78 50.85,12.93 50.85,15.16 v51.27,15.58
  Bottom 0.203: v58.1,14.63 v56.04,14.63 55.4,15.58 52.88,15.58 52.79,15.67 52.29,15.67 52.2,15.58 v51.27,15.58

### Text on the board
tNames: CMOS / BCD / Crap / Clock v1.1 | 8 | youtube.com/davidwatts | 256HZ | Binary coded decimal / of each time digit. | 4 | 2 | 32HZ | 1 | LED | + | -
bNames: LED ENABLE | 1HZ | CLK | MAN | RESET | <--- 2048HZ